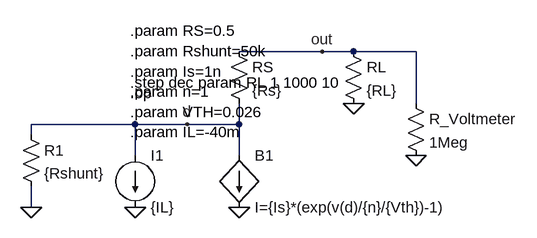
[diagram p0: schematic Solar Cell Modeling.asc]
Solar Cell Modeling.asc, the LTspice schematic file:
Version 4
SHEET 1 880 680
WIRE 304 0 176 0
WIRE 352 0 304 0
WIRE 448 0 352 0
WIRE 448 80 448 0
WIRE 16 112 -144 112
WIRE 96 112 16 112
WIRE 176 112 176 80
WIRE 176 112 96 112
WIRE -144 128 -144 112
WIRE 16 160 16 112
WIRE 176 160 176 112
WIRE -144 240 -144 208
FLAG 448 160 0
FLAG 176 240 0
FLAG 16 240 0
FLAG 96 112 d
FLAG 304 0 out
FLAG 352 80 0
FLAG -144 240 0
SYMBOL bi 176 160 R0
SYMATTR InstName B1
SYMATTR Value I={Is}*(exp(v(d)/{n}/{Vth})-1)
SYMBOL current 16 160 R0
WINDOW 123 0 0 Left 0
WINDOW 39 0 0 Left 0
SYMATTR InstName I1
SYMATTR Value {IL}
SYMBOL res 160 -16 R0
SYMATTR InstName RS
SYMATTR Value {Rs}
SYMBOL res 432 64 R0
SYMATTR InstName R_Voltmeter
SYMATTR Value 1Meg
SYMBOL res 336 -16 R0
SYMATTR InstName RL
SYMATTR Value {RL}
SYMBOL res -160 112 R0
SYMATTR InstName R1
SYMATTR Value {Rshunt}
TEXT 8 48 Left 0 !.step dec param RL 1 1000 10
TEXT 8 64 Left 0 !.op
TEXT 8 -32 Left 0 !.param RS=0.5\n.param Rshunt=50k\n.param Is=1n\n.param n=1\n.param VTH=0.026\n.param IL=-40m

The netlist it stands for:
* Solar Cell Modeling.asc
B1 d 0 I={Is}*(exp(v(d)/{n}/{Vth})-1)
I1 d 0 {IL}
RS out d {Rs}
R_Voltmeter out 0 1Meg
RL out 0 {RL}
R1 d 0 {Rshunt}
.step dec param RL 1 1000 10
.op
.param RS=0.5
.param Rshunt=50k
.param Is=1n
.param n=1
.param VTH=0.026
.param IL=-40m
.backanno
.end

* Results of the author's LTspice run, read from the files saved beside the schematic
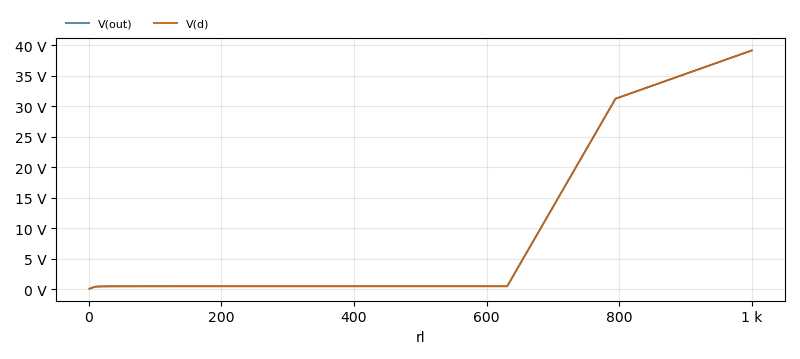
[diagram p1: Operating Point of Solar Cell Modeling.asc, plotted from the saved traces]
* Operating Point, 1 run:
*   V(out): 40 mV at rl=1 , 39.15 V at rl=1 k, min 40 mV, max 39.15 V
*   V(d): 60 mV at rl=1 , 39.17 V at rl=1 k, min 60 mV, max 39.17 V